# EasyEDA schematic SCH_Robot Arm_2022-05-23.json
TITLE: Sheet_1; REV: 1.0; Date: 2022-05-23; Sheet: 1/1; Drawn By: emarchet7; Company: Your Company
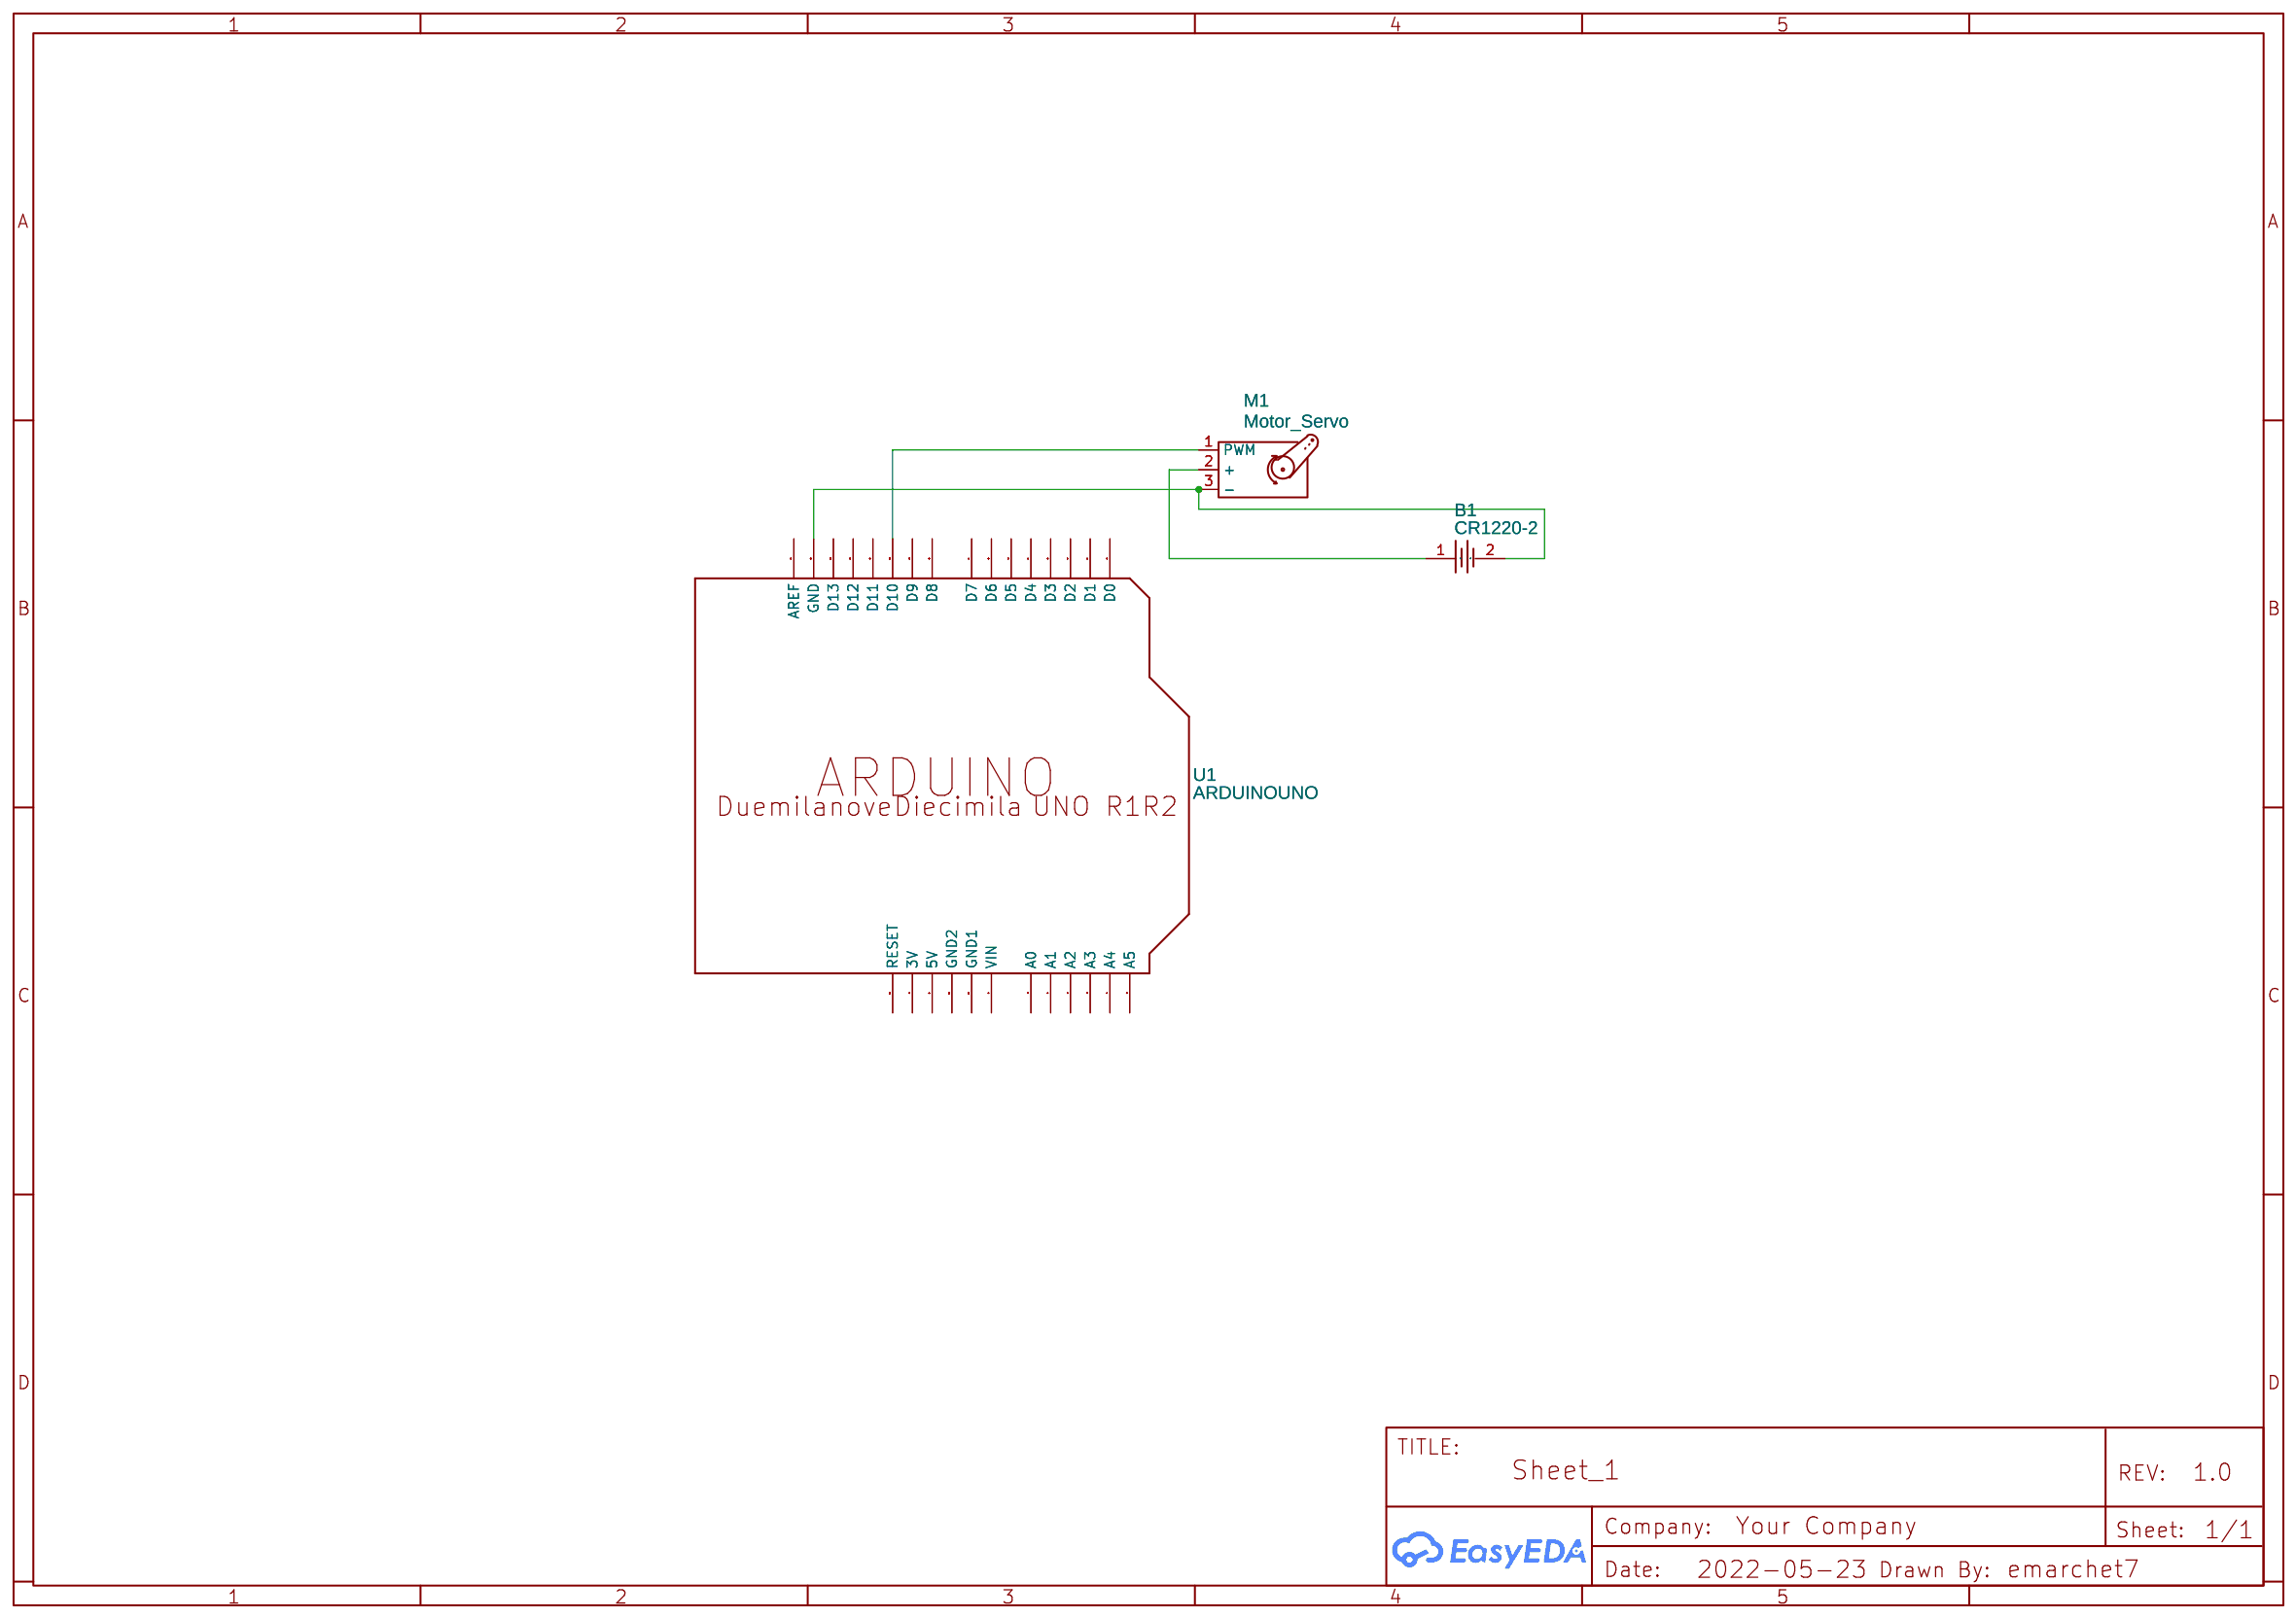
[diagram p0: schematic sheet]

## Parts
B1  CR1220-2  [BAT-SMD_CR1220-2]
M1  Motor_Servo
U1  ARDUINOUNO  [ARDUINO]

## Library data of the parts
B1 = CR1220-2: Supplier: LCSC; Manufacturer: Q&J; image: //image.lceda.cn/szlcsc/C70381.jpg; Supplier Part: C70381
M1 = Motor_Servo: Contributor: KiCAD; license: https://www.gnu.org/licenses/lgpl-2.1.html
U1 = ARDUINOUNO: Arduino DiecimilaDuemilanove; Contributor: Adafruit

## Nets
Net-(B1-1): B1.1 M1.2(+)
Net-(B1-2): B1.2 M1.3(-) U1.GND
Net-(M1-1): M1.1(PWM) U1.D10

Not connected (* = marked no-connect by the designer): U1 3V 5V A0 A1 A2 A3 A4 A5 AREF D0 D1 D2 D3 D4 D5 D6 D7 D8 D9 D11 D12 D13 GND1 GND2 RESET VIN
